# Altium schematic sheet machnguon.SchDoc
size A
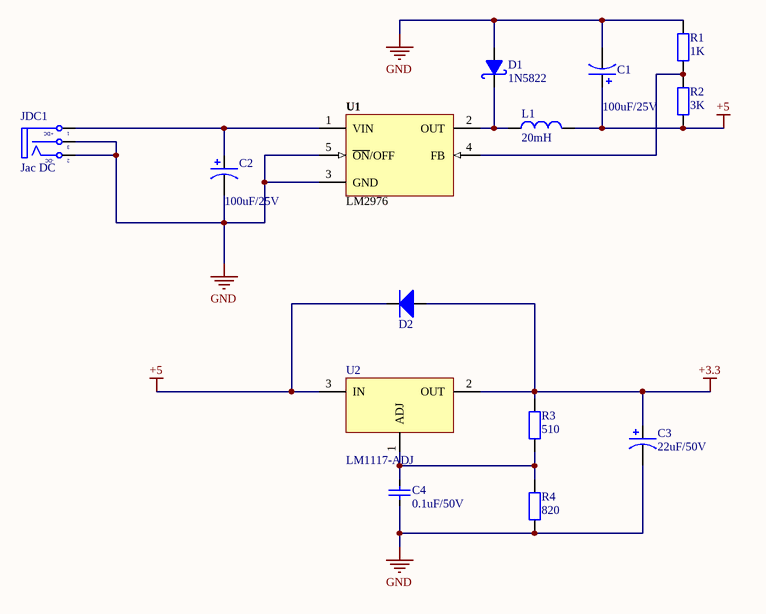
[diagram p0: machnguon.SchDoc]

## Parts
C1  100uF/25V  [C3MM]
C2  100uF/25V  [C3MM]
C3  22uF/50V  [C3MM]
C4  0.1uF/50V  [CAP_0805]
D1  1N5822  [SMA]
D2  Diode SMD  [DIO-SMD-106]  (value not drawn)
JDC1  Jac DC  [DC-IN]
L1  20mH  [L-SMD-M-7.3x4.5]
R1  1K  [RES-SMD-0805]
R2  3K  [RES-SMD-0805]
R3  510  [RES-SMD-0805]
R4  820  [RES-SMD-0805]
U1  LM2976  [TO263]
U2  LM1117-ADJ  [LM1117-SOP]

## Nets
+3.3: C3.1 D2.1(A) R3.1 U2.2(OUT)
+5: C1.1 D2.2(K) L1.2 R2.2 U2.3(IN)
GND: C1.2 C2.2 C3.2 C4.1 D1.1(A) JDC1.2(TN) JDC1.3(S) R1.1 R4.2 U1.3(GND) U1.5(~{ON}/OFF)
NetC2_1: C2.1 JDC1.1(T) U1.1(VIN)
NetC4_2: C4.2 R3.2 R4.1 U2.1(ADJ)
NetD1_2: D1.2(K) L1.1 U1.2(OUT)
NetR1_2: R1.2 R2.1 U1.4(FB)

## Notes on the sheet
- (in symbol DCIN) +DC; -DC

## Library data of the parts
C1-C3 = Cap Pol: Polarized Capacitor (Axial); Published: 8-Jun-2000; LatestRevisionDate: 17-Jul-2002; LatestRevisionNote: Re-released for DXP Platform.; PackageReference: POLAR0.8; Publisher: Altium Limited
C4 = CapSMD: Capacitor; Value: 33p; Published: 8-Jun-2000; LatestRevisionDate: 17-Jul-2002; LatestRevisionNote: Re-released for DXP Platform.; PackageReference: RAD-0.3; Publisher: Altium Limited
D1 = 1N5822: Schottky Rectifiers; Value: Diode c?m 1N5408
D2 = Diode SMD: Default Diode; Code - JEDEC: DO-214-AB; Value: 1N5007; Published: 8-Jun-2000; Revision: July-2002: Re-released for DXP Platform.; Publisher: Altium Limited
JDC1 = DCIN: Jac DC input; Value: Jac DC
L1 = Inductor: VALUE: 150 mH
R1-R4 = Resistor - SMD: Resistor SMD; Manufacturer: Generic Components; Class: Passive; Published: 08/06/2000; Publisher: Altium Hobart Technology Centre
U1 = LM2596: Max Input Voltage: 12 V; Max Output Current: 3 (6.0 peak) A; Max Output Voltage: mV; Category: IC-Power; Min Input Voltage: mV; Min Output Voltage: mV; Mounting Technology: Surface Mount; Status: Unreleased; Supply Voltage: mV; Temperature Range: -40 to +125 degC
U2 = LM1117-ADJ: 800mA Low-Dropout Linear Regulator; Creator: Nguyen Ba Bien; Website: http://group3i.net